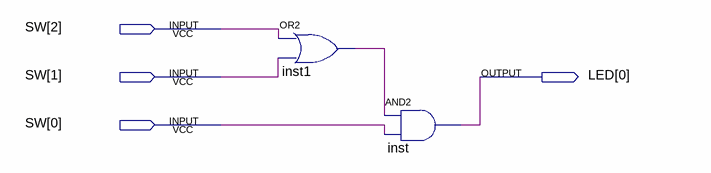
[diagram p0: schematic sheet]
// Quartus schematic ex_2.bdf as structural Verilog: 2 symbols, 4 pins
module ex_2 (
  input  [2:0] SW,
  output [0:0] LED
);

  wire inst1_out;

  or inst1 (inst1_out, SW[2], SW[1]);
  and inst (LED[0], inst1_out, SW[0]);
endmodule
